# Altium project mutual_cap_v2.PrjPcb
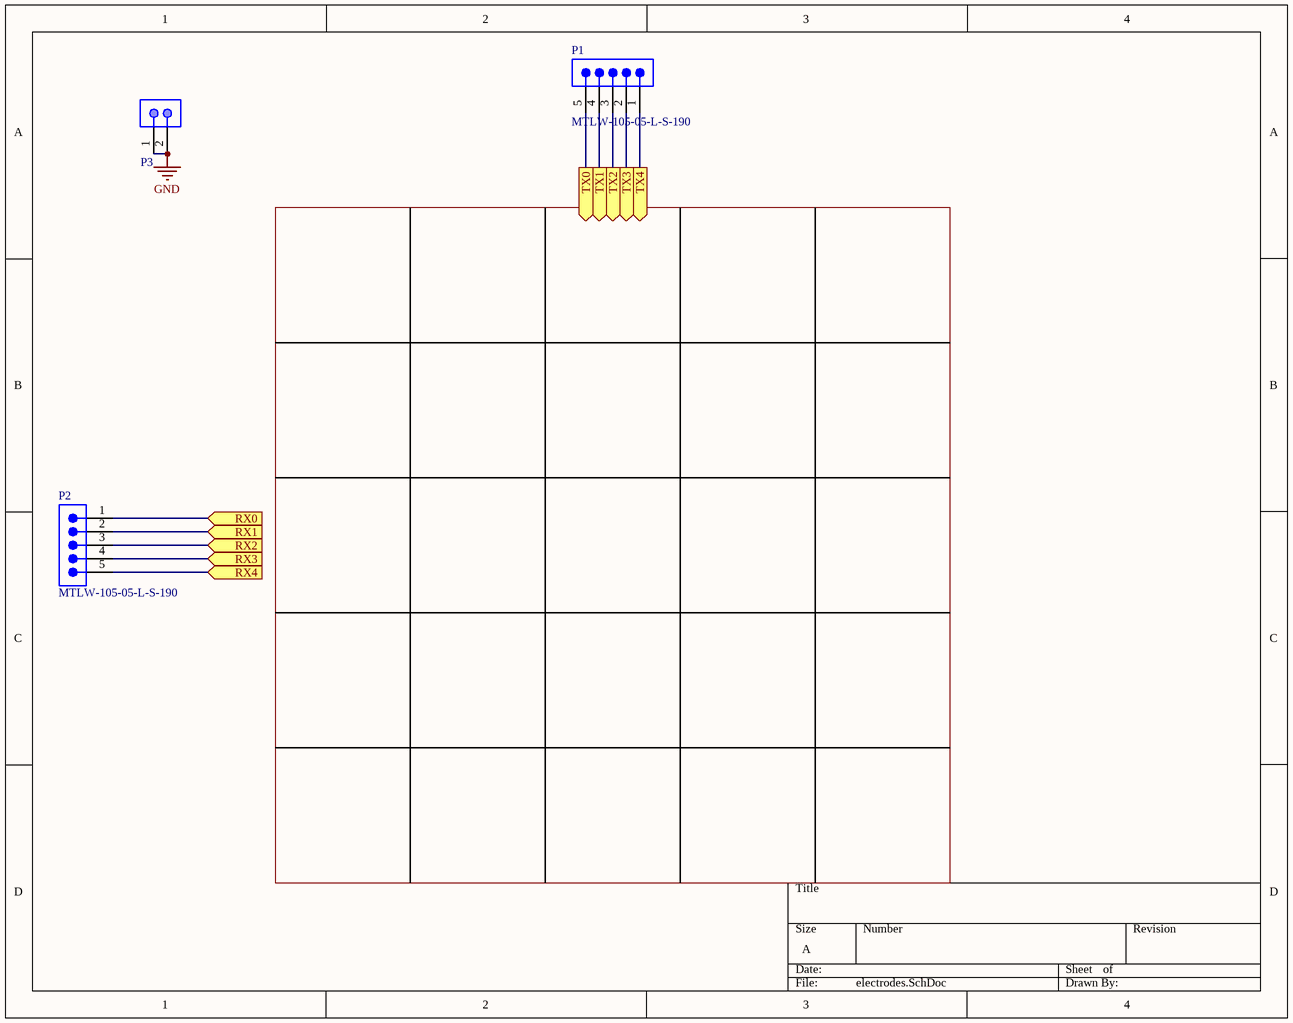
[diagram p0: electrodes.SchDoc]
1 sheet, 3 parts. Net scope: flat (ports and power ports of the same name join across sheets).
Board file: M_PCT.PcbDoc

## Sheet electrodes.SchDoc
size A

### Parts
P1  MTLW-105-05-L-S-190  [SMTC-MTLW-105-05-X-S-190]
P2  MTLW-105-05-L-S-190  [SMTC-MTLW-105-05-X-S-190]
P3  613 002 111 21  [WE-61300211121_V]  (value not drawn)

### Ports
RX0 (in), RX1 (in), RX2 (in), RX3 (in), RX4 (in), TX0 (out), TX1 (out), TX2 (out), TX3 (out), TX4 (out)

### Nets
GND: P3.1 P3.2
NetP1_1: P1.1 ; port TX4
NetP1_2: P1.2 ; port TX3
NetP1_3: P1.3 ; port TX2
NetP1_4: P1.4 ; port TX1
NetP1_5: P1.5 ; port TX0
NetP2_1: P2.1 ; port RX0
NetP2_2: P2.2 ; port RX1
NetP2_3: P2.3 ; port RX2
NetP2_4: P2.4 ; port RX3
NetP2_5: P2.5 ; port RX4

### Library data of the parts
P1 P2 = CMP-1024-00079-1: Low Profile .025" SQ Post Header, Through-hole, Vertical, -55 to 125 degC, 2.54 mm Pitch, 5-Pin, Male, RoHS; Manufacturer: Samtec; Pitch: 2.54 mm; Mounting Technology: Through-hole; ComponentLink2Description: Datasheet; DatasheetVersion: F-214; Temperature Range: -55 to 125 degC; ComponentLink1Description: Manufacturer URL; Orientation: Vertical; ComponentLink2URL: http://www.samtec.com/documents/webfiles/pdf/MTLW_TH.PDF; PackageDescription: Low Profile Terminal Assembly; PackageVersion: T, 6/1991; RoHS: True; ComponentLink3Description: Package Specification; ComponentLink1URL: http://www.samtec.com; PackageReference: MTLW-105-05-X-S-190; ComponentLink3URL: http://www.samtec.com/documents/webfiles/cpdf/MTLW-1XX-XX-XX-X-XXX-XX-XX-MKT1.pdf; PartNumber: MTLW-105-05-L-S-190
P3 = CMP-1712-00002-1: Male Header, Pitch 2.54 mm, 1 x 2 Position, Height 8.54 mm, Tail Length 3 mm, -40 to 105 degC, RoHS, Bulk; Manufacturer: Wuerth Elektronik; DatasheetVersion: Rev. J; ComponentLink1Description: Manufacturer URL; ComponentLink2URL: http://katalog.we-online.de/em/datasheet/6130xx11121.pdf; PackageReference: 61300211121; ComponentLink2Description: Datasheet; Mounting Technology: Through Hole; PackageDescription: Male Header, Pitch 2.54 mm, 1 x 2 Position, Height 8.54 mm, Tail Length 3 mm; ComponentLink1URL: https://www.we-online.com/; PartNumber: 613 002 111 21